# EAGLE design backplane (EAGLE 6.6.0)
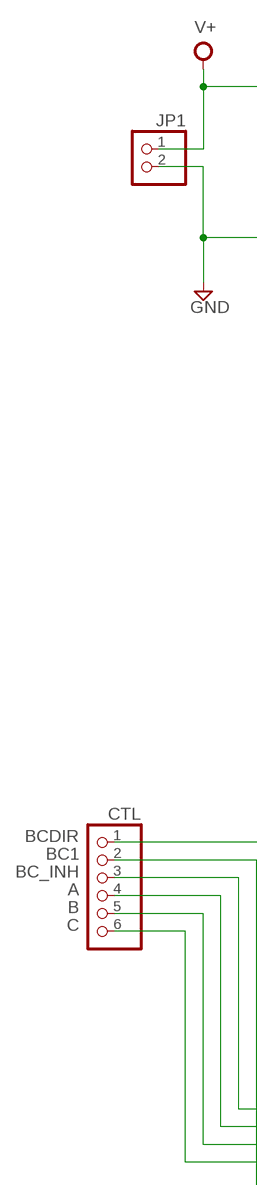
[diagram p0: schematic, sheet 1, part 1 of 2]
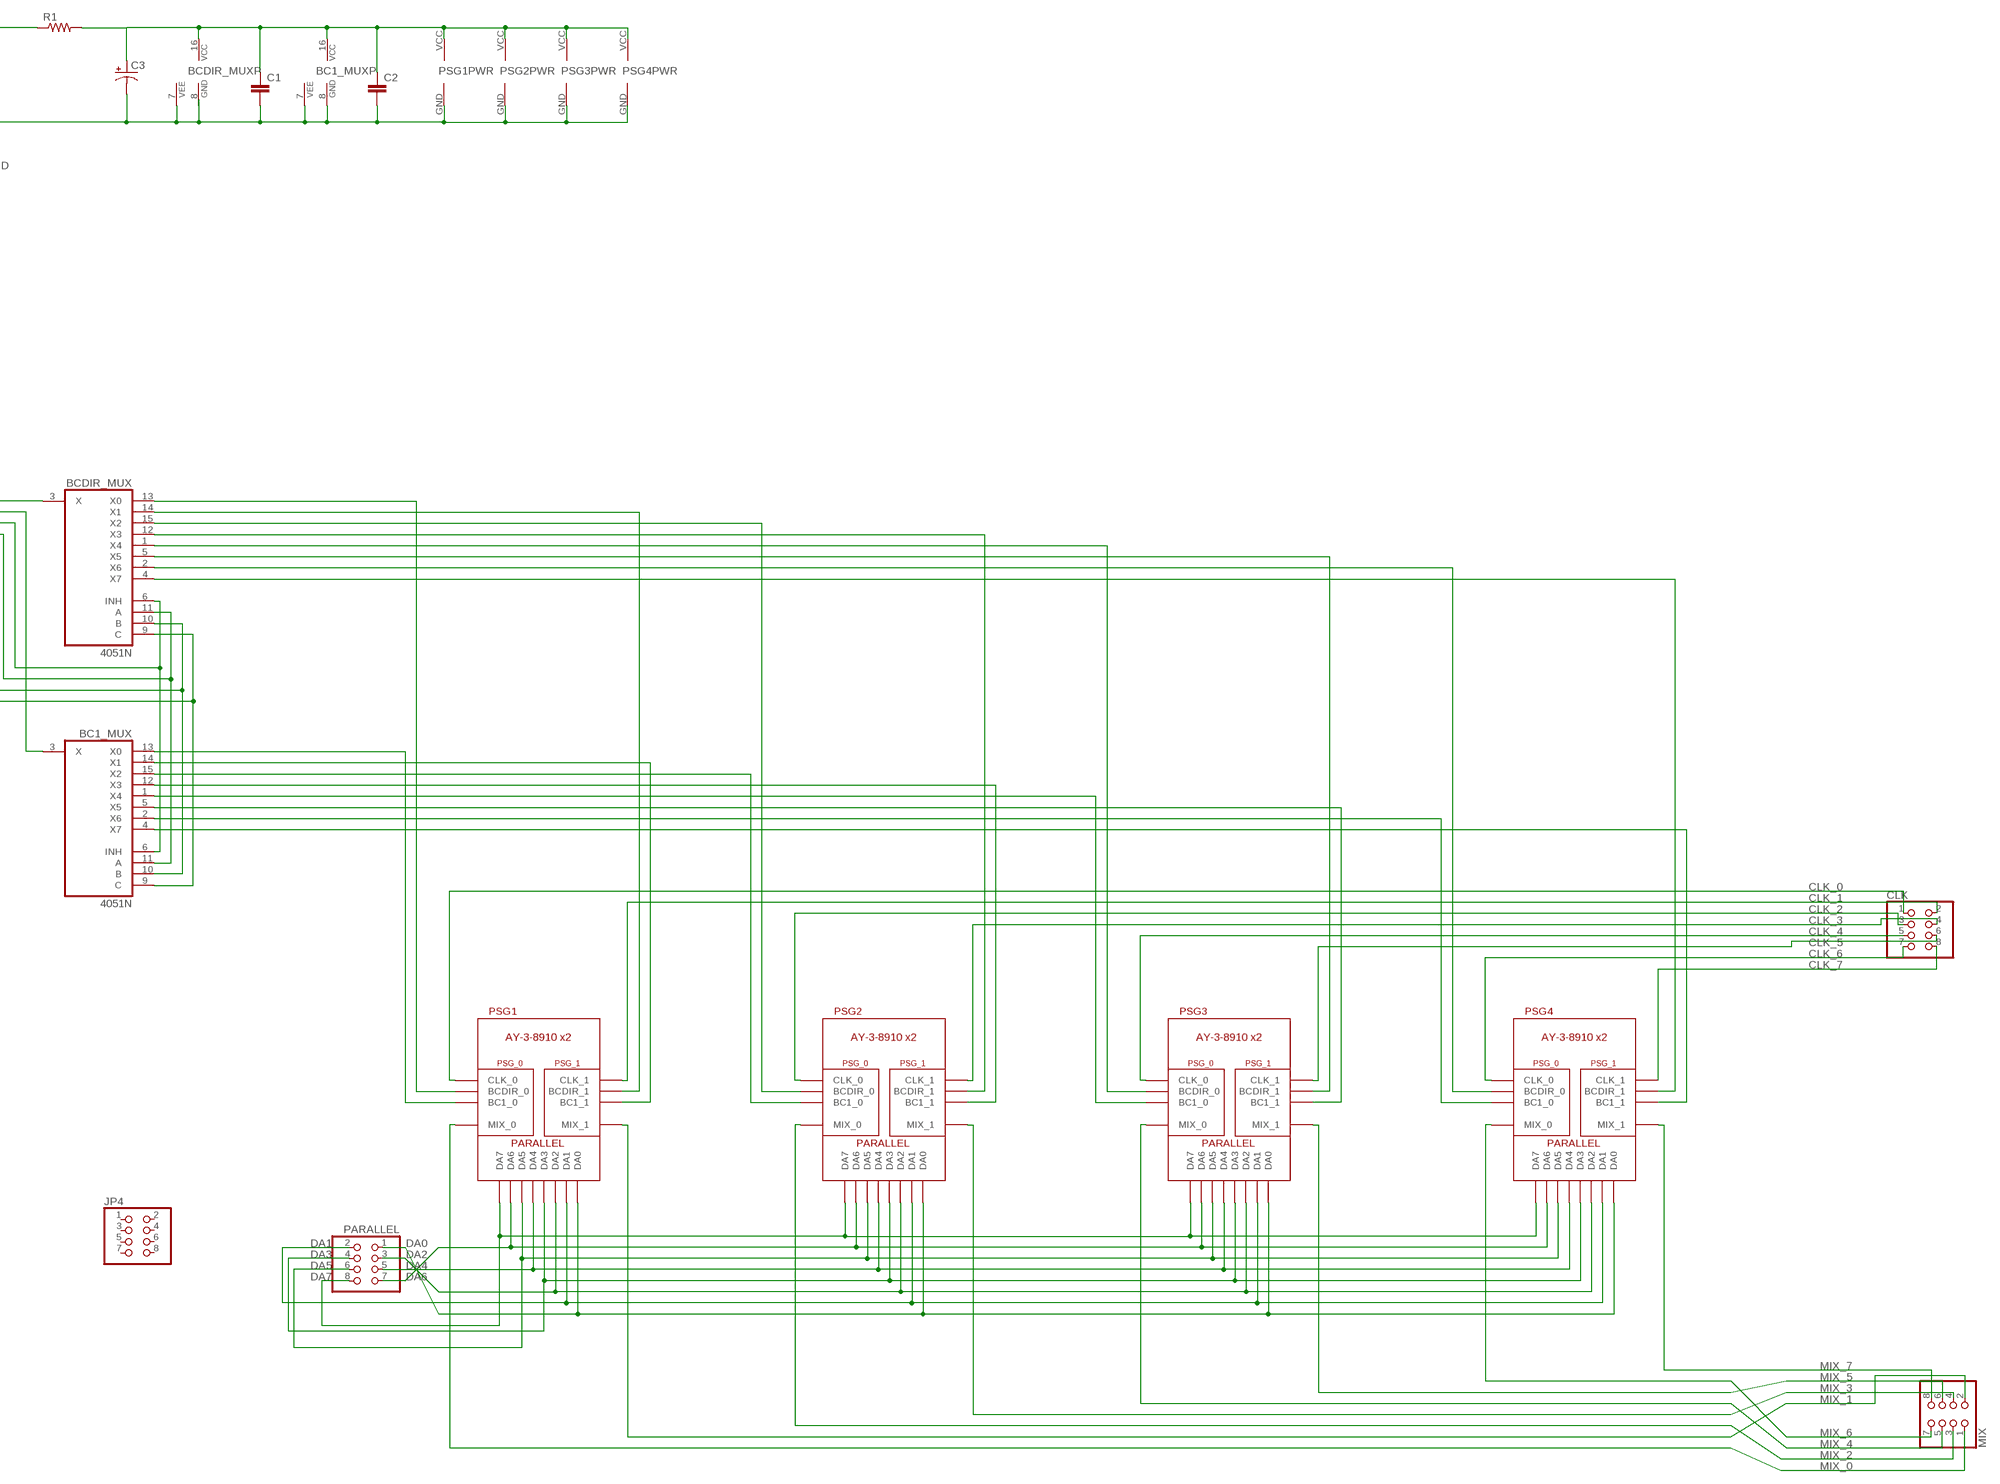
[diagram p1: schematic, sheet 1, part 2 of 2]

## Parts
BC1_MUX  4051N  [DIL16]
BCDIR_MUX  4051N  [DIL16]
C1  050X030_0251  [050X030_025]
C2  050X030_0251  [050X030_025]
C3  0631  [063_025]
CLK  PINHD-2X4  [2X04]
CTL  PINHD-1X6  [1X06]
JP1  PINHD-1X2  [1X02]
JP4  PINHD-2X4  [2X04]
MIX  PINHD-2X4  [2X04]
PARALLEL  PINHD-2X4  [2X04]
PSG1  DUAL_PSG_DAUGHTER  [DUAL_PSG_DAUGHTER]
PSG2  DUAL_PSG_DAUGHTER  [DUAL_PSG_DAUGHTER]
PSG3  DUAL_PSG_DAUGHTER  [DUAL_PSG_DAUGHTER]
PSG4  DUAL_PSG_DAUGHTER  [DUAL_PSG_DAUGHTER]
R1  6MM.3  [R0207/3]

## Nets
3: BCDIR_MUX.12(X3) PSG2.BCDIR_1
A: BC1_MUX.11(A) BCDIR_MUX.11(A) CTL.4
B: BC1_MUX.10(B) BCDIR_MUX.10(B) CTL.5
BC1: BC1_MUX.3(X) CTL.2
BC1_0: BC1_MUX.13(X0) PSG1.BC1_0
BC1_1: BC1_MUX.14(X1) PSG1.BC1_1
BC1_2: BC1_MUX.15(X2) PSG2.BC1_0
BC1_3: BC1_MUX.12(X3) PSG2.BC1_1
BC1_4: BC1_MUX.1(X4) PSG3.BC1_0
BC1_5: BC1_MUX.5(X5) PSG3.BC1_1
BC1_6: BC1_MUX.2(X6) PSG4.BC1_0
BC1_7: BC1_MUX.4(X7) PSG4.BC1_1
BC_INH: BC1_MUX.6(INH) BCDIR_MUX.6(INH) CTL.3
BCDIR: BCDIR_MUX.3(X) CTL.1
BCDIR_0: BCDIR_MUX.13(X0) PSG1.BCDIR_0
BCDIR_1: BCDIR_MUX.14(X1) PSG1.BCDIR_1
BCDIR_2: BCDIR_MUX.15(X2) PSG2.BCDIR_0
BCDIR_4: BCDIR_MUX.1(X4) PSG3.BCDIR_0
BCDIR_5: BCDIR_MUX.5(X5) PSG3.BCDIR_1
BCDIR_6: BCDIR_MUX.2(X6) PSG4.BCDIR_0
BCDIR_7: BCDIR_MUX.4(X7) PSG4.BCDIR_1
C: BC1_MUX.9(C) BCDIR_MUX.9(C) CTL.6
CLK_0: CLK.1 PSG1.CLK_0
CLK_1: CLK.2 PSG1.CLK_1
CLK_2: CLK.3 PSG2.CLK_0
CLK_3: CLK.4 PSG2.CLK_1
CLK_4: CLK.5 PSG3.CLK_0
CLK_5: CLK.6 PSG3.CLK_1
CLK_6: CLK.7 PSG4.CLK_0
CLK_7: CLK.8 PSG4.CLK_1
DA0: PARALLEL.1 PSG1.DA0 PSG2.DA0 PSG3.DA0 PSG4.DA0
DA1: PARALLEL.2 PSG1.DA1 PSG2.DA1 PSG3.DA1 PSG4.DA1
DA2: PARALLEL.3 PSG1.DA2 PSG2.DA2 PSG3.DA2 PSG4.DA2
DA3: PARALLEL.4 PSG1.DA3 PSG2.DA3 PSG3.DA3 PSG4.DA3
DA4: PARALLEL.5 PSG1.DA4 PSG2.DA4 PSG3.DA4 PSG4.DA4
DA5: PARALLEL.6 PSG1.DA5 PSG2.DA5 PSG3.DA5 PSG4.DA5
DA6: PARALLEL.7 PSG1.DA6 PSG2.DA6 PSG3.DA6 PSG4.DA6
DA7: PARALLEL.8 PSG1.DA7 PSG2.DA7 PSG3.DA7 PSG4.DA7
GND: BC1_MUX.7(VEE) BC1_MUX.8(GND) BCDIR_MUX.7(VEE) C1.2 C2.2 C3.- JP1.2 PSG1.GND PSG2.GND PSG3.GND PSG4.GND
MIX_0: MIX.1 PSG1.MIX_0
MIX_1: MIX.2 PSG1.MIX_1
MIX_2: MIX.3 PSG2.MIX_0
MIX_3: MIX.4 PSG2.MIX_1
MIX_4: MIX.5 PSG3.MIX_0
MIX_5: MIX.6 PSG3.MIX_1
MIX_6: MIX.7 PSG4.MIX_0
MIX_7: MIX.8 PSG4.MIX_1
N$1: BC1_MUX.16(VCC) BCDIR_MUX.16(VCC) C1.1 C2.1 C3.+ PSG1.VCC PSG2.VCC PSG3.VCC PSG4.VCC R1.2
V+: JP1.1 R1.1
Unconnected: JP4.1 JP4.2 JP4.3 JP4.4 JP4.5 JP4.6 JP4.7 JP4.8

## Power pins joined to a net without a drawn wire
GND: BCDIR_MUX.8(GND)

## Library data of the parts
BC1_MUX BCDIR_MUX = 40xx:4051: 8-channel ANALOG MULTIPLEXER
C1 C2 = gm-caps-ceramic:050X030_025: 47 - 120pF Xicon Ceramic Disc 2.5mm lead spacing
C3 = gm-caps-electro-pol:063: 33 - 220uF Xicon values at Mouser.com 10V: 220uF; 16V: 100uF; 25V: 100uF; 50V: 33uF
CLK JP4 MIX PARALLEL = pinhead:PINHD-2X4: PIN HEADER
CTL = pinhead:PINHD-1X6: PIN HEADER
JP1 = pinhead:PINHD-1X2: PIN HEADER
PSG1-PSG4 = jaapie:DUAL_PSG_DAUGHTER
R1 = gm-resistors:6MM: 6mm Resistors Leads spaced 1-6 holes apart for 0.1" perfboard. Suitable for 1/4 watt resistors.

## Board
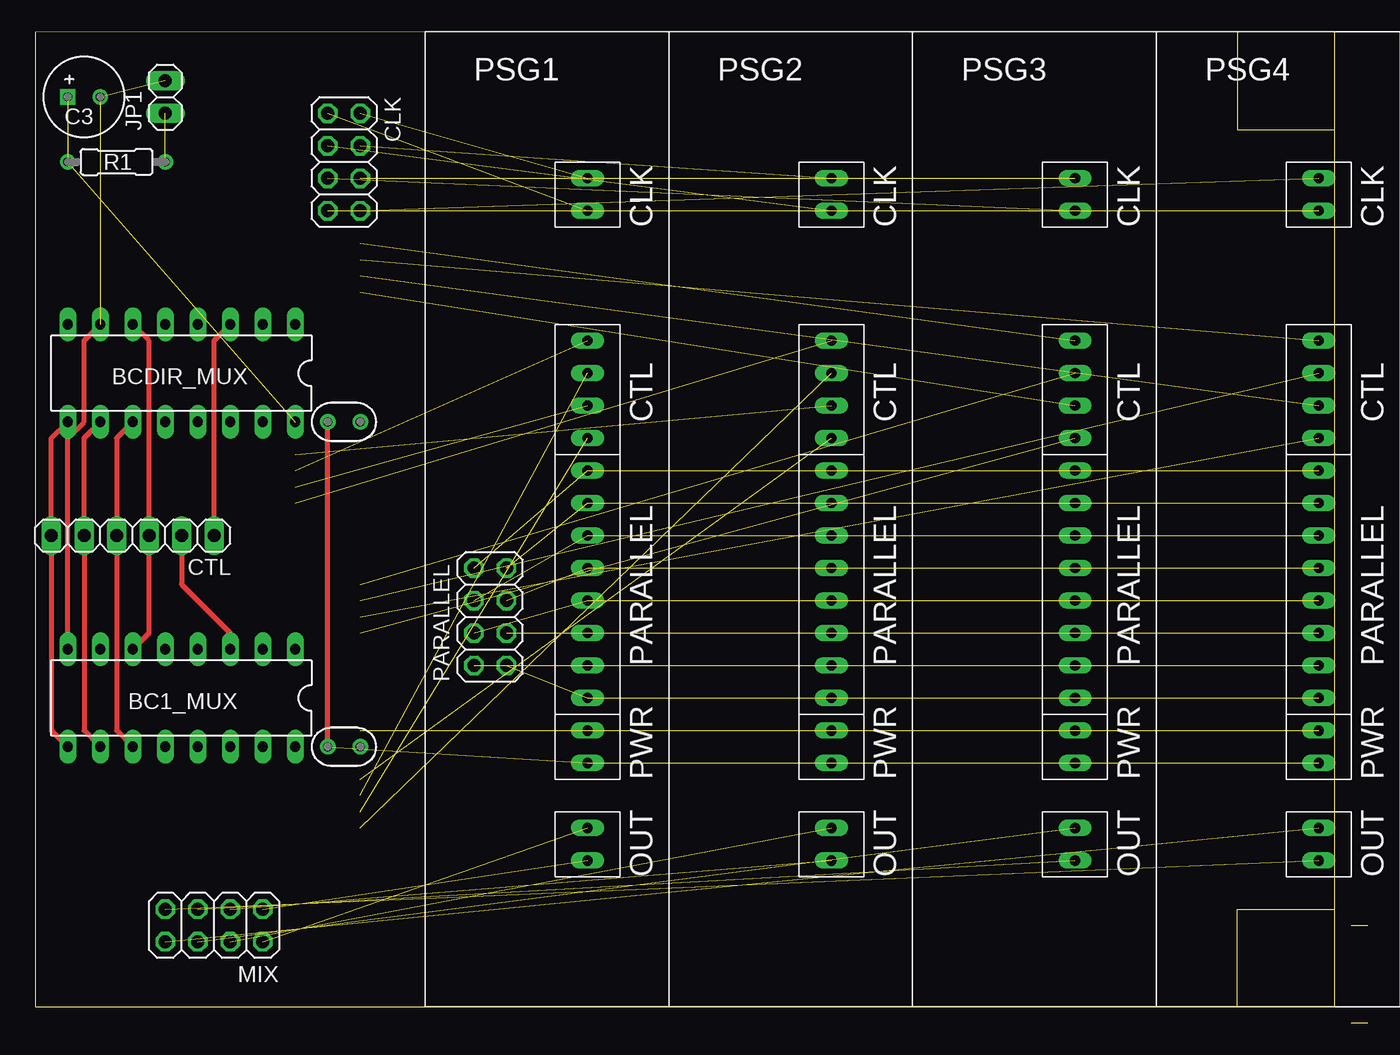
[diagram p2: board, top side]
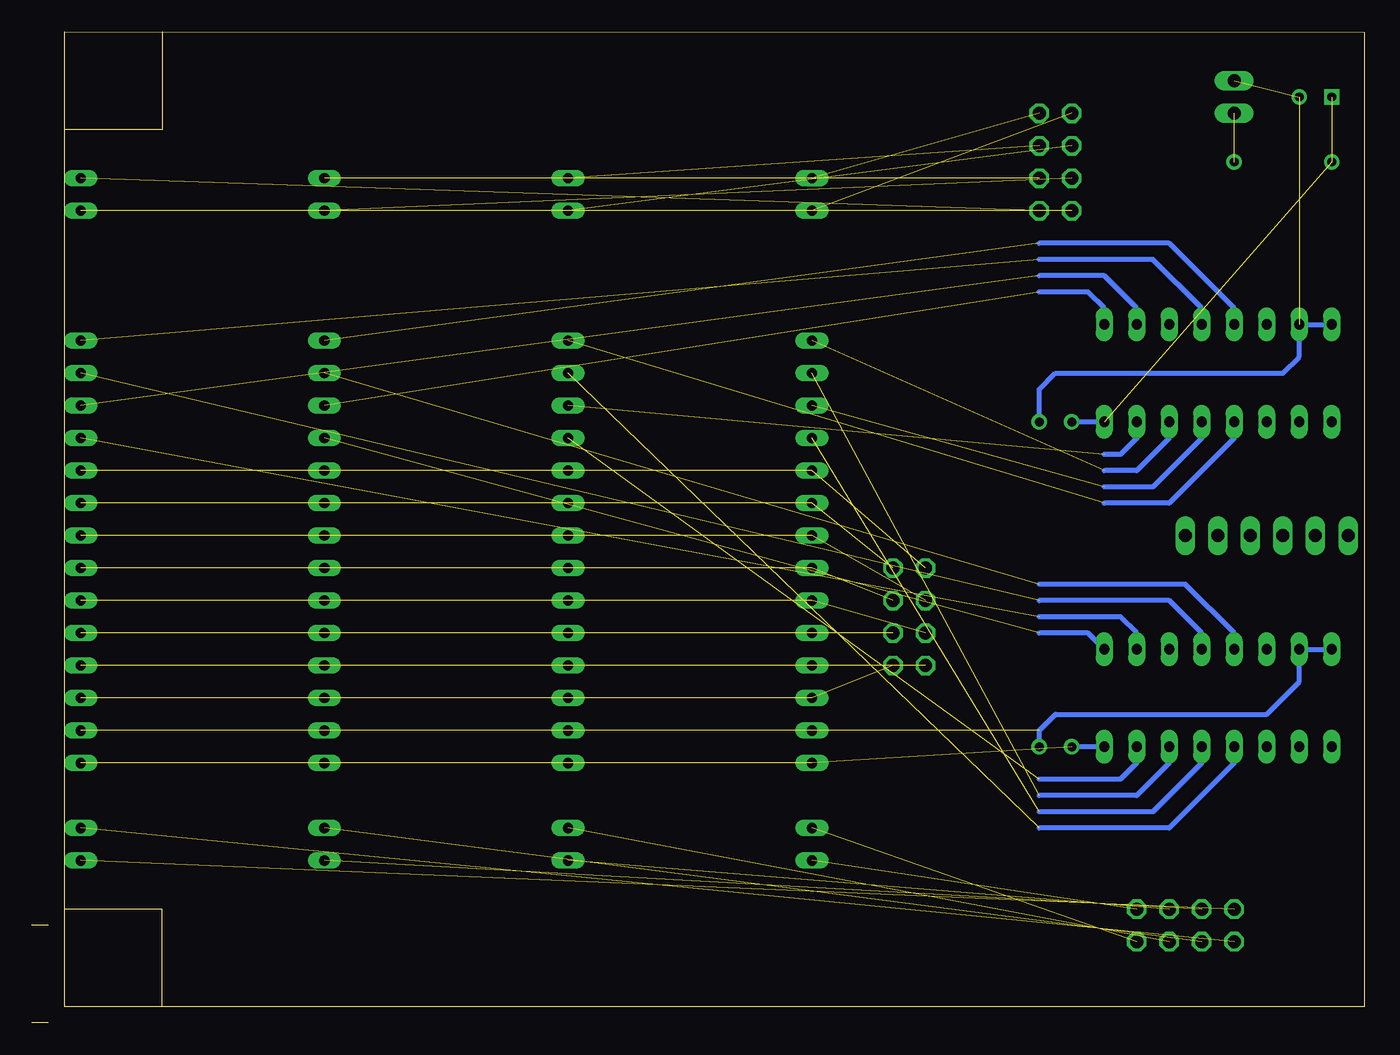
[diagram p3: board, bottom side, seen from below]

Size 104.14 x 77.47 mm. Coordinates in mm from the lower left corner, seen from the top.
Outline: 93.98,1.27 0,1.27 0,77.46 101.6,77.47 101.6,69.85
Outline: 93.98,1.27 101.6,1.27 101.6,8.89
Outline: 101.6,8.89 101.6,69.85
Outline: 93.98,1.27 93.98,8.89 101.6,8.89
Outline: 93.98,77.47 93.98,69.85 101.6,69.85
Outline: 102.87,0 104.14,0
Outline: 102.87,7.62 104.14,7.62
Copper layers (1*16): Top 0.035mm / dielectric 1.5mm / Bottom 0.035mm
Design rules "default": minimum track width 10mil, minimum drill 24mil, track to track 8mil, track to pad 8mil, pad to pad 8mil, via to via 8mil, smd to smd 8mil, copper to edge 40mil, drill to drill 8mil, minimum pad ring 10mil, minimum via ring 8mil, stop-mask expansion 4mil, vias tented up to drill 0mil, thermal gap 10mil

### Footprints (pad centres in the part's own frame; a part is rotated, then mirrored left to right if it is on the bottom)
DIL16 = drill 0.813 long: 1 -8.89,-3.81; 2 -6.35,-3.81; 3 -3.81,-3.81; 4 -1.27,-3.81; 5 1.27,-3.81; 6 3.81,-3.81; 7 6.35,-3.81; 8 8.89,-3.81; 9 8.89,3.81; 10 6.35,3.81; 11 3.81,3.81; 12 1.27,3.81; 13 -1.27,3.81; 14 -3.81,3.81; 15 -6.35,3.81; 16 -8.89,3.81
050X030_025 = drill 0.7: 1 -1.27,0; 2 1.27,0
063_025 = drill 0.7 square: + -1.27,0 | drill 0.7: - 1.27,0
2X04 = drill 1.016 octagon: 1 -3.81,-1.27; 2 -3.81,1.27; 3 -1.27,-1.27; 4 -1.27,1.27; 5 1.27,-1.27; 6 1.27,1.27; 7 3.81,-1.27; 8 3.81,1.27
1X06 = drill 1.016 long: 1 -6.35,0; 2 -3.81,0; 3 -1.27,0; 4 1.27,0; 5 3.81,0; 6 6.35,0
1X02 = drill 1.016 long: 1 -1.27,0; 2 1.27,0
DUAL_PSG_DAUGHTER = drill 0.8 long: BC1_0 0,44.45; BC1_1 0,49.53; BCDIR_0 0,46.99; BCDIR_1 0,52.07; CLK_0 0,62.23; CLK_1 0,64.77; DA0 0,24.13; DA1 0,26.67; DA2 0,29.21; DA3 0,31.75; DA4 0,34.29; DA5 0,36.83; DA6 0,39.37; DA7 0,41.91; GND 0,21.59; MIX_0 0,11.43; MIX_1 0,13.97; VCC 0,19.05
R0207/3 = drill 0.7: 1 -3.81,0; 2 3.81,0

### Placement (x,y rotation side)
BC1_MUX  11.43,25.4 180 top
BCDIR_MUX  11.43,50.8 180 top
C1  24.13,46.99 0 top
C2  24.13,21.59 0 top
C3  3.81,72.39 0 top
CLK  24.13,67.31 270 top
CTL  7.62,38.1 180 top
JP1  10.16,72.39 90 top
JP4  -85.09,-20.32 0 top  (outside the outline)
MIX  13.97,7.62 180 top
PARALLEL  35.56,31.75 90 top
PSG1  43.18,1.27 0 top
PSG2  62.23,1.27 0 top
PSG3  81.28,1.27 0 top
PSG4  100.33,1.27 0 top
R1  6.35,67.31 180 top

### Tracks (layer width: path | path; a pad name or v marks a point on that pad's centre or on a via)
3  (1 unrouted)
  Bottom 0.406: BCDIR_MUX.12 10.16,45.72 15.24,40.64 20.32,40.64
A
  Top 0.406: BCDIR_MUX.11 6.35,45.72 CTL.4 6.35,22.86 BC1_MUX.11
B
  Top 0.406: BC1_MUX.10 3.81,22.86 CTL.5 3.81,45.72 BCDIR_MUX.10
BC1
  Top 0.406: CTL.2 11.43,34.29 15.24,30.48 BC1_MUX.3
BC1_0  (1 unrouted)
  Bottom 0.406: BC1_MUX.13 12.7,20.32 16.51,16.51 25.4,16.51
BC1_1  (1 unrouted)
  Bottom 0.406: BC1_MUX.14 15.24,20.32 17.78,17.78 25.4,17.78
BC1_2  (1 unrouted)
  Bottom 0.406: BC1_MUX.15 17.78,20.32 19.05,19.05 25.4,19.05
BC1_3  (1 unrouted)
  Bottom 0.406: BC1_MUX.12 10.16,20.32 15.24,15.24 25.4,15.24
BC1_4  (1 unrouted)
  Bottom 0.406: BC1_MUX.1 21.59,30.48 25.4,30.48
BC1_5  (1 unrouted)
  Bottom 0.406: BC1_MUX.5 10.16,30.48 13.97,34.29 25.4,34.29
BC1_6  (1 unrouted)
  Bottom 0.406: BC1_MUX.2 17.78,30.48 19.05,31.75 25.4,31.75
BC1_7  (1 unrouted)
  Bottom 0.406: BC1_MUX.4 12.7,30.48 15.24,33.02 25.4,33.02
BC_INH
  Top 0.406: BC1_MUX.6 8.89,30.48 CTL.3 8.89,53.34 BCDIR_MUX.6
BCDIR
  Top 0.406: CTL.1 13.97,53.34 BCDIR_MUX.3
BCDIR_0  (1 unrouted)
  Bottom 0.406: BCDIR_MUX.13 12.7,45.72 16.51,41.91 20.32,41.91
BCDIR_1  (1 unrouted)
  Bottom 0.406: BCDIR_MUX.14 15.24,45.72 17.78,43.18 20.32,43.18
BCDIR_2  (1 unrouted)
  Bottom 0.406: BCDIR_MUX.15 17.78,45.72 19.05,44.45 20.32,44.45
BCDIR_4  (1 unrouted)
  Bottom 0.406: BCDIR_MUX.1 20.32,55.88 21.59,57.15 25.4,57.15
BCDIR_5  (1 unrouted)
  Bottom 0.406: BCDIR_MUX.5 10.16,55.88 15.24,60.96 25.4,60.96
BCDIR_6  (1 unrouted)
  Bottom 0.406: BCDIR_MUX.2 17.78,55.88 20.32,58.42 25.4,58.42
BCDIR_7  (1 unrouted)
  Bottom 0.406: BCDIR_MUX.4 12.7,55.88 16.51,59.69 25.4,59.69
C
  Top 0.406: BC1_MUX.9 1.27,22.86 CTL.6 1.27,45.72 BCDIR_MUX.9
CLK_0  (1 unrouted)
CLK_1  (1 unrouted)
CLK_2  (1 unrouted)
CLK_3  (1 unrouted)
CLK_4  (1 unrouted)
CLK_5  (1 unrouted)
CLK_6  (1 unrouted)
CLK_7  (1 unrouted)
DA0  (4 unrouted)
DA1  (4 unrouted)
DA2  (4 unrouted)
DA3  (4 unrouted)
DA4  (4 unrouted)
DA5  (4 unrouted)
DA6  (4 unrouted)
DA7  (4 unrouted)
GND  (6 unrouted)
  Top 0.406: BC1_MUX.8 2.54,45.72 3.81,46.99 3.81,53.34 BCDIR_MUX.7
  Bottom 0.406: BCDIR_MUX.8 BCDIR_MUX.7 5.08,52.07 6.35,50.8 24.13,50.8 25.4,49.53 C1.2 | BC1_MUX.8 BC1_MUX.7 5.08,26.67 7.62,24.13 24.13,24.13 25.4,22.86 C2.2
MIX_0  (1 unrouted)
MIX_1  (1 unrouted)
MIX_2  (1 unrouted)
MIX_3  (1 unrouted)
MIX_4  (1 unrouted)
MIX_5  (1 unrouted)
MIX_6  (1 unrouted)
MIX_7  (1 unrouted)
N$1  (6 unrouted)
  Top 0.406: C2.1 C1.1
  Bottom 0.406: BCDIR_MUX.16 C1.1 | BC1_MUX.16 C2.1
V+  (1 unrouted)